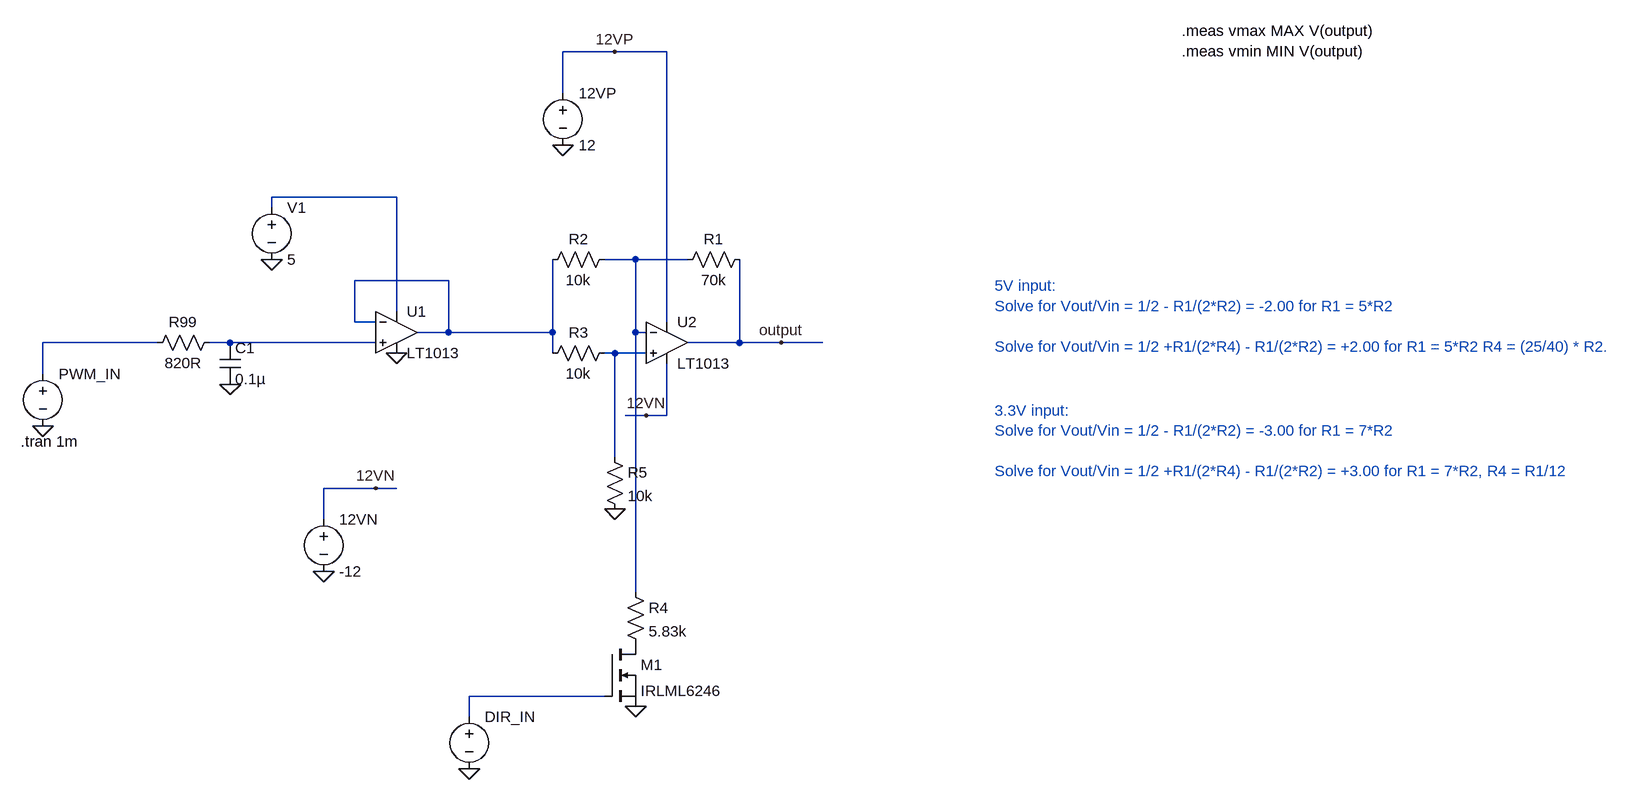
[diagram p0: schematic pwmdir-to-analog-nomux.asc]
pwmdir-to-analog-nomux.asc, the LTspice schematic file:
Version 4
SHEET 1 2836 756
WIRE 912 -368 832 -368
WIRE 992 -368 912 -368
WIRE 832 -304 832 -368
WIRE 576 -144 384 -144
WIRE 384 -128 384 -144
WIRE 944 -48 896 -48
WIRE 1024 -48 944 -48
WIRE 656 -16 512 -16
WIRE 576 32 576 -144
WIRE 512 48 512 -16
WIRE 544 48 512 48
WIRE 992 48 992 -368
WIRE 656 64 656 -16
WIRE 656 64 608 64
WIRE 816 64 816 -48
WIRE 816 64 656 64
WIRE 944 64 944 -48
WIRE 960 64 944 64
WIRE 208 80 32 80
WIRE 320 80 288 80
WIRE 544 80 320 80
WIRE 1104 80 1104 -48
WIRE 1104 80 1024 80
WIRE 1168 80 1104 80
WIRE 1232 80 1168 80
WIRE 816 96 816 64
WIRE 912 96 896 96
WIRE 960 96 912 96
WIRE 32 128 32 80
WIRE 960 192 928 192
WIRE 992 192 992 112
WIRE 992 192 960 192
WIRE 912 256 912 96
WIRE 544 304 464 304
WIRE 576 304 544 304
WIRE 464 352 464 304
WIRE 944 464 944 64
WIRE 896 624 688 624
WIRE 688 656 688 624
FLAG 32 208 0
FLAG 320 144 0
FLAG 384 -48 0
FLAG 576 96 0
FLAG 832 -224 0
FLAG 464 432 0
FLAG 912 -368 12VP
FLAG 544 304 12VN
FLAG 960 192 12VN
FLAG 912 336 0
FLAG 688 736 0
FLAG 944 640 0
FLAG 1168 80 output
SYMBOL voltage 32 112 R0
WINDOW 3 24 96 Invisible 2
WINDOW 123 0 0 Left 0
WINDOW 39 0 0 Left 0
SYMATTR InstName PWM_IN
SYMATTR Value PULSE(0 3.3 0 10n 10n 0.5u 1u)
SYMBOL res 304 64 R90
WINDOW 0 0 56 VBottom 2
WINDOW 3 32 56 VTop 2
SYMATTR InstName R99
SYMATTR Value 820R
SYMBOL cap 304 80 R0
SYMATTR InstName C1
SYMATTR Value 0.1µ
SYMBOL OpAmps\\LT1013 576 0 R0
SYMATTR InstName U1
SYMBOL voltage 384 -144 R0
WINDOW 123 0 0 Left 0
WINDOW 39 0 0 Left 0
SYMATTR InstName V1
SYMATTR Value 5
SYMBOL OpAmps\\LT1013 992 16 R0
SYMATTR InstName U2
SYMBOL voltage 832 -320 R0
WINDOW 123 0 0 Left 0
WINDOW 39 0 0 Left 0
SYMATTR InstName 12VP
SYMATTR Value 12
SYMBOL voltage 464 336 R0
WINDOW 123 0 0 Left 0
WINDOW 39 0 0 Left 0
SYMATTR InstName 12VN
SYMATTR Value -12
SYMBOL voltage 688 640 R0
WINDOW 3 24 96 Invisible 2
WINDOW 123 0 0 Left 0
WINDOW 39 0 0 Left 0
SYMATTR InstName DIR_IN
SYMATTR Value PULSE(0 3.3 0.5m 10n 10n 1m 1m)
SYMBOL res 912 80 R90
WINDOW 0 0 56 VBottom 2
WINDOW 3 32 56 VTop 2
SYMATTR InstName R3
SYMATTR Value 10k
SYMBOL res 896 240 R0
SYMATTR InstName R5
SYMATTR Value 10k
SYMBOL res 912 -64 R90
WINDOW 0 0 56 VBottom 2
WINDOW 3 32 56 VTop 2
SYMATTR InstName R2
SYMATTR Value 10k
SYMBOL res 928 448 R0
SYMATTR InstName R4
SYMATTR Value 5.83k
SYMBOL nmos 896 544 R0
SYMATTR InstName M1
SYMATTR Value IRLML6246
SYMBOL res 1120 -64 R90
WINDOW 0 0 56 VBottom 2
WINDOW 3 32 56 VTop 2
SYMATTR InstName R1
SYMATTR Value 70k
TEXT -2 232 Left 2 !.tran 1m
TEXT 1784 -400 Left 2 !.meas vmax MAX V(output)\n.meas vmin MIN V(output)
TEXT 1496 -8 Left 2 ;5V input:\nSolve for Vout/Vin = 1/2 - R1/(2*R2) = -2.00 for R1 = 5*R2\n \nSolve for Vout/Vin = 1/2 +R1/(2*R4) - R1/(2*R2) = +2.00 for R1 = 5*R2 R4 = (25/40) * R2.
TEXT 1496 184 Left 2 ;3.3V input:\nSolve for Vout/Vin = 1/2 - R1/(2*R2) = -3.00 for R1 = 7*R2\n \nSolve for Vout/Vin = 1/2 +R1/(2*R4) - R1/(2*R2) = +3.00 for R1 = 7*R2, R4 = R1/12

The netlist it stands for:
* pwmdir-to-analog-nomux.asc
V§PWM_IN N004 0 PULSE(0 3.3 0 10n 10n 0.5u 1u)
R99 N005 N004 820R
C1 N005 0 0.1µ
XU1 N005 N003 N001 0 N003 LT1013  ; pins In+ In- V+ V- OUT
V1 N001 0 5
XU2 N006 N002 12VP 12VN output LT1013  ; pins In+ In- V+ V- OUT
V§12VP 12VP 0 12
V§12VN 12VN 0 -12
V§DIR_IN N007 0 PULSE(0 3.3 0.5m 10n 10n 1m 1m)
R3 N006 N003 10k
R5 N006 0 10k
R2 N002 N003 10k
R4 N002 P001 5.83k
M1 P001 N007 0 0 IRLML6246
R1 output N002 70k
.model NMOS NMOS
.model PMOS PMOS
.lib standard.mos
.tran 1m
.meas vmax MAX V(output)
.meas vmin MIN V(output)
* 5V input:
* Solve for Vout/Vin = 1/2 - R1/(2*R2) = -2.00 for R1 = 5*R2
* Solve for Vout/Vin = 1/2 +R1/(2*R4) - R1/(2*R2) = +2.00 for R1 = 5*R2 R4 = (25/40) * R2.
* 3.3V input:
* Solve for Vout/Vin = 1/2 - R1/(2*R2) = -3.00 for R1 = 7*R2
* Solve for Vout/Vin = 1/2 +R1/(2*R4) - R1/(2*R2) = +3.00 for R1 = 7*R2, R4 = R1/12
.lib LTC.lib
.backanno
.end